# Altium schematic sheet 1WB_DS2502_ID.SchDoc: Protected 1-Wire EPROM
size A4; DocumentNumber: 32; SheetNumber: 33; SheetTotal: 77; Organization: Altium Limited.; Address1: Level 3, 12a Rodborough Rd; Address2: Frenchs Forest 2086; Address3: NSW; Address4: AUSTRALIA
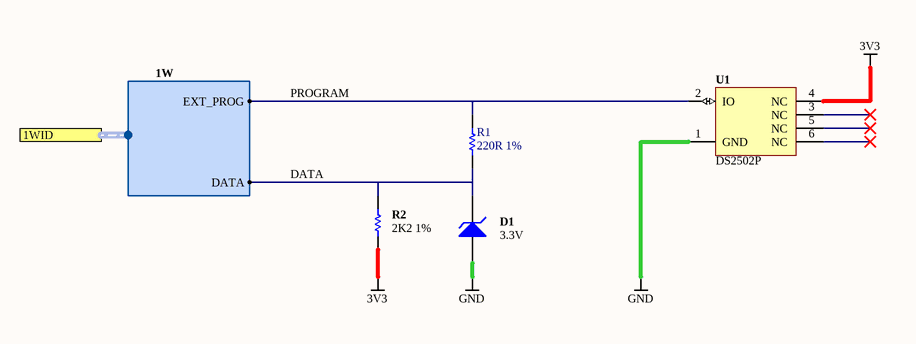
[diagram p0: 1WB_DS2502_ID.SchDoc]

## Parts
D1  3.3V  [SOT95P230-3D]
R1  220R 1%  [RESC1005-STAR]
R2  2K2 1%  [RESC1005-STAR]
U1  DS2502P  [DSO-C6-D4]

## Ports
1WID (harness 1W)

## Harnesses
1W: DATA, EXT_PROG

## Nets
3V3: R2.2 U1.4(NC)
GND: D1.1(A) U1.1(GND)
DATA: D1.2(K) R1.2 R2.1 ; port 1WID.DATA
PROGRAM: R1.1 U1.2(IO) ; port 1WID.EXT_PROG

Not connected (* = marked no-connect by the designer): U1 3(NC)* 5(NC)* 6(NC)*

## Notes on the sheet
- Sheet Title
- Project Title
- Size:
- Date:
- A4
- Assy:
- Time:
- Revision:
- Sheet
- of
- File:

## Library data of the parts
D1 = D-150-0005: Zener Diode, 3.3V; Max Forward Current: mA; Mounting Technology: Surface Mount; Rated Voltage: 3.3 V; Status: Production; Category: Diode-Zener
R1 = D-100-0115: Resistor, 220R 1% 0402 (1005); Power Rating: 63 mW; Category: Resistor; Mounting Technology: Surface Mount; Resistance: 220 R; Status: Production; Tolerance: 1 %
R2 = D-100-0107: Resistor, 2K2 1% 0402 (1005); Power Rating: 63 mW; Resistance: 2.2 K; Category: Resistor; Mounting Technology: Surface Mount; Status: Production; Tolerance: 1 %
U1 = D-263-0008: EPROM, 1-wire, 1024-bit, Surface Mount; Bit Length: Bits; Speed: 15.4 or 125 kbps ps; Supply Voltage: 2.8 to 6 V; Bit Width: Bits; Mounting Technology: Surface Mount; Status: Unreleased; Technology: EE; Temperature Range: -40 to +85 degC; Category: IC-PROM